# Altium schematic sheet OUTPUT.SchDoc
size A4; SheetNumber: 5; SheetTotal: 6
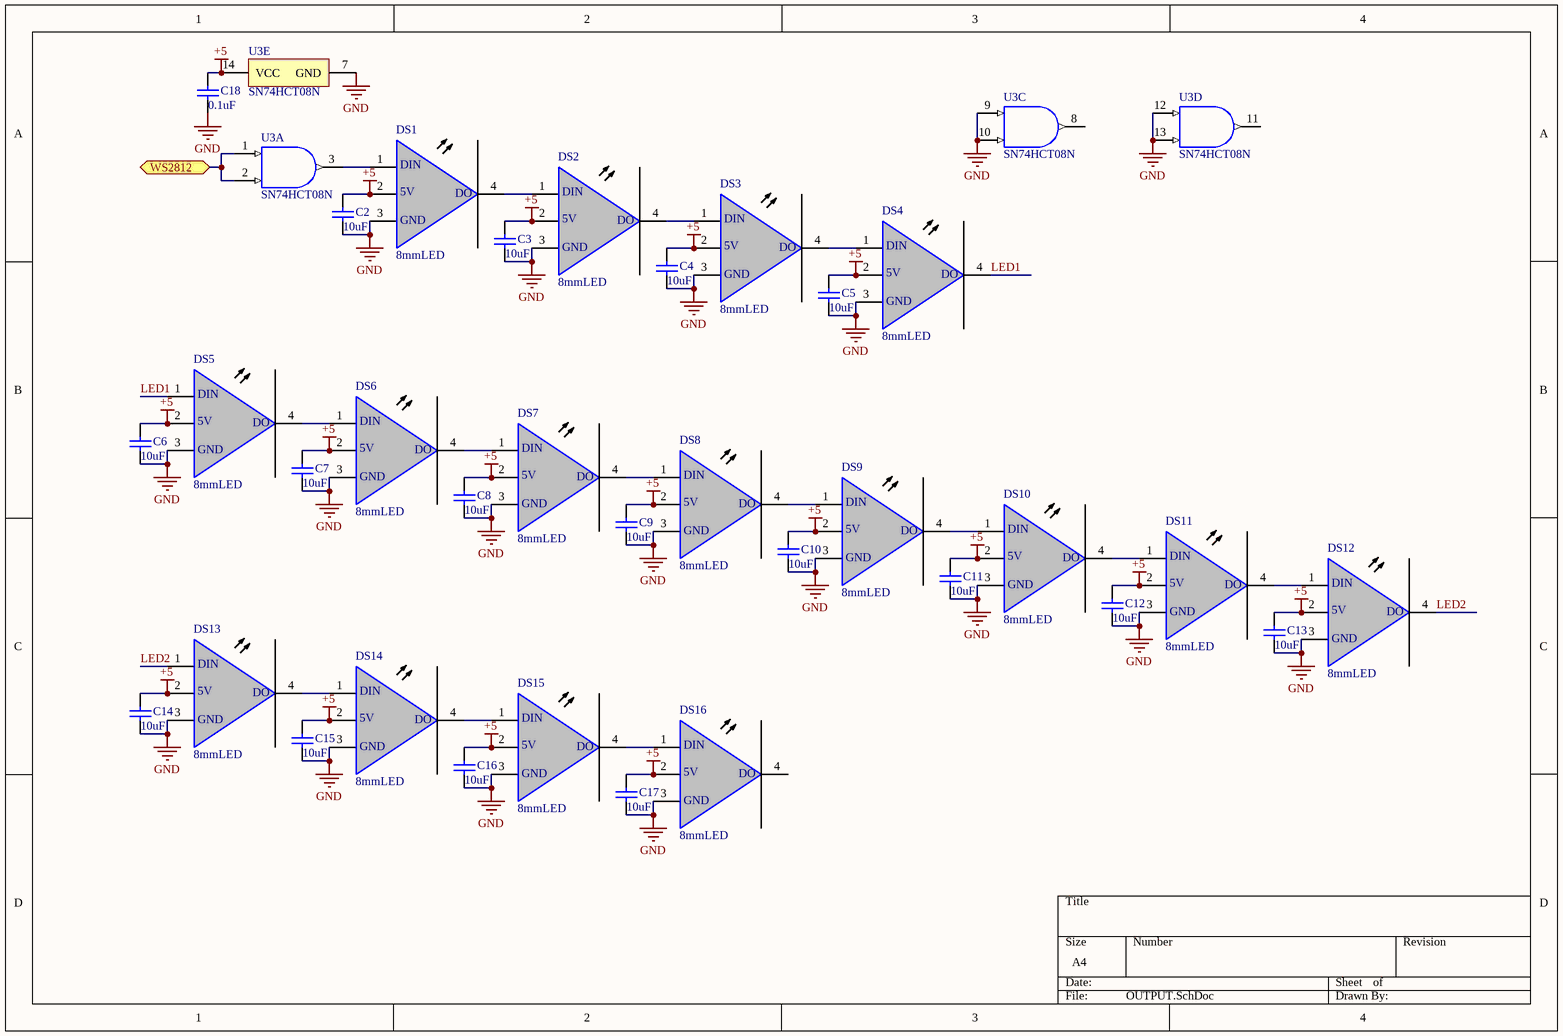
[diagram p0: OUTPUT.SchDoc]

## Parts
C2  10uF  [CAPR51-254-508X318X736]
C3  10uF  [CAPR51-254-508X318X736]
C4  10uF  [CAPR51-254-508X318X736]
C5  10uF  [CAPR51-254-508X318X736]
C6  10uF  [CAPR51-254-508X318X736]
C7  10uF  [CAPR51-254-508X318X736]
C8  10uF  [CAPR51-254-508X318X736]
C9  10uF  [CAPR51-254-508X318X736]
C10  10uF  [CAPR51-254-508X318X736]
C11  10uF  [CAPR51-254-508X318X736]
C12  10uF  [CAPR51-254-508X318X736]
C13  10uF  [CAPR51-254-508X318X736]
C14  10uF  [CAPR51-254-508X318X736]
C15  10uF  [CAPR51-254-508X318X736]
C16  10uF  [CAPR51-254-508X318X736]
C17  10uF  [CAPR51-254-508X318X736]
C18  0.1uF  [CAPR51-254-508X318X736]
DS1  8mmLED  [8mm]
DS2  8mmLED  [8mm]
DS3  8mmLED  [8mm]
DS4  8mmLED  [8mm]
DS5  8mmLED  [8mm]
DS6  8mmLED  [8mm]
DS7  8mmLED  [8mm]
DS8  8mmLED  [8mm]
DS9  8mmLED  [8mm]
DS10  8mmLED  [8mm]
DS11  8mmLED  [8mm]
DS12  8mmLED  [8mm]
DS13  8mmLED  [8mm]
DS14  8mmLED  [8mm]
DS15  8mmLED  [8mm]
DS16  8mmLED  [8mm]
U3  SN74HCT08N  [N0014A]  (parts A,C,D,E of 5)

## Ports
WS2812 (bidir, see Main[3B], MCU[2B])

## Nets
+5: C2.2 C3.2 C4.2 C5.2 C6.2 C7.2 C8.2 C9.2 C10.2 C11.2 C12.2 C13.2 C14.2 C15.2 C16.2 C17.2 C18.2 DS1.2(CATHODE) DS2.2(CATHODE) DS3.2(CATHODE) DS4.2(CATHODE) DS5.2(CATHODE) DS6.2(CATHODE) DS7.2(CATHODE) DS8.2(CATHODE) DS9.2(CATHODE) DS10.2(CATHODE) DS11.2(CATHODE) DS12.2(CATHODE) DS13.2(CATHODE) DS14.2(CATHODE) DS15.2(CATHODE) DS16.2(CATHODE) U3.14(VCC)
GND: C2.1 C3.1 C4.1 C5.1 C6.1 C7.1 C8.1 C9.1 C10.1 C11.1 C12.1 C13.1 C14.1 C15.1 C16.1 C17.1 C18.1 DS1.3(BLUE) DS2.3(BLUE) DS3.3(BLUE) DS4.3(BLUE) DS5.3(BLUE) DS6.3(BLUE) DS7.3(BLUE) DS8.3(BLUE) DS9.3(BLUE) DS10.3(BLUE) DS11.3(BLUE) DS12.3(BLUE) DS13.3(BLUE) DS14.3(BLUE) DS15.3(BLUE) DS16.3(BLUE) U3.7(GND) U3.9(3A) U3.10(3B) U3.12(4A) U3.13(4B)
LED1: DS4.4(GREEN) DS5.1(RED)
LED2: DS12.4(GREEN) DS13.1(RED)
WS2812: U3.1(1A) U3.2(1B) ; port WS2812
NetDS1_1: DS1.1(RED) U3.3(1Y)
NetDS1_4: DS1.4(GREEN) DS2.1(RED)
NetDS2_4: DS2.4(GREEN) DS3.1(RED)
NetDS3_4: DS3.4(GREEN) DS4.1(RED)
NetDS5_4: DS5.4(GREEN) DS6.1(RED)
NetDS6_4: DS6.4(GREEN) DS7.1(RED)
NetDS7_4: DS7.4(GREEN) DS8.1(RED)
NetDS8_4: DS8.4(GREEN) DS9.1(RED)
NetDS9_4: DS9.4(GREEN) DS10.1(RED)
NetDS10_4: DS10.4(GREEN) DS11.1(RED)
NetDS11_4: DS11.4(GREEN) DS12.1(RED)
NetDS13_4: DS13.4(GREEN) DS14.1(RED)
NetDS14_4: DS14.4(GREEN) DS15.1(RED)
NetDS15_4: DS15.4(GREEN) DS16.1(RED)

Not connected (* = marked no-connect by the designer): DS16 4(GREEN); U3 8(3Y) 11(4Y)

## Notes on the sheet
- (in symbol 8mmLED) DIN; 5V; DO; GND

## Library data of the parts
C2-C18 = CMP-1664-00004-1: Radial Leaded Multilayer Ceramic Capacitor, 0.1 uF, +/- 10%, 50 V, -55 to 125 degC, 2-Pin THD, RoHS, Tape and Reel; Case\Package: SOT-23-5; Max Power Dissipation: 250 mW; Output Current: 150 mA; Dropout Voltage: 260 mV; Outputs: 1; Output Voltage: 5 V; Max Input Voltage: 8 V; Min Operating Temperature: -40 degC; Packaging: Tape and Reel; Height: 1.3 mm; Radiation Hardening: No; Pins: 5; ComponentLink1Description: Manufacturer URL; Mount: Surface Mount; RoHSCompliant: true; Max Operating Temperature: 85 degC; PackageReference: CAPR51-254-508X318X736; ComponentLink2URL: http://www.kemet.com/docfinder?Partnumber=C320C104K5R5TA; PackageDescription: 2-Pin Through Hole Device, Body 5.08 x 3.18 mm, Pitch 2.54 mm; ComponentLink1URL: http://www.kemet.com/; Width: 1.8 mm; Package Quantity: 3000; DatasheetVersion: Dec-15; Length: 3 mm; ComponentLink2Description: Datasheet
DS1-DS16 = 8mmLED: WS2812
U3 = CMP-0777-00257-3: Quadruple 2-Input Positive-AND Gates, N0014A, TUBE; Manufacturer: Texas Instruments; VCC(Max)(V): 5.5; Technology Family: HCT; tpd @ Nom Voltage(Max)(ns): 27; F @ Nom Voltage(Max)(Mhz): 25; ICC @ Nom Voltage(Max)(mA): 0.02; Rating: Catalog; Output Drive (IOL/IOH)(Max)(mA): -5.2/5.2; Output Type: CMOS; Input Type: TTL; Voltage(Nom)(V): 5; Schmitt Trigger: Yes; VCC(Min)(V): 4.5; Bits(#): 4; Generic Part Number: SN74HCT08; DatasheetVersion: SCLS063D; Operating Temperature Range(C): -40 to 85; PackageReference: N0014A